# Altium schematic sheet vehicle.SchDoc
size A
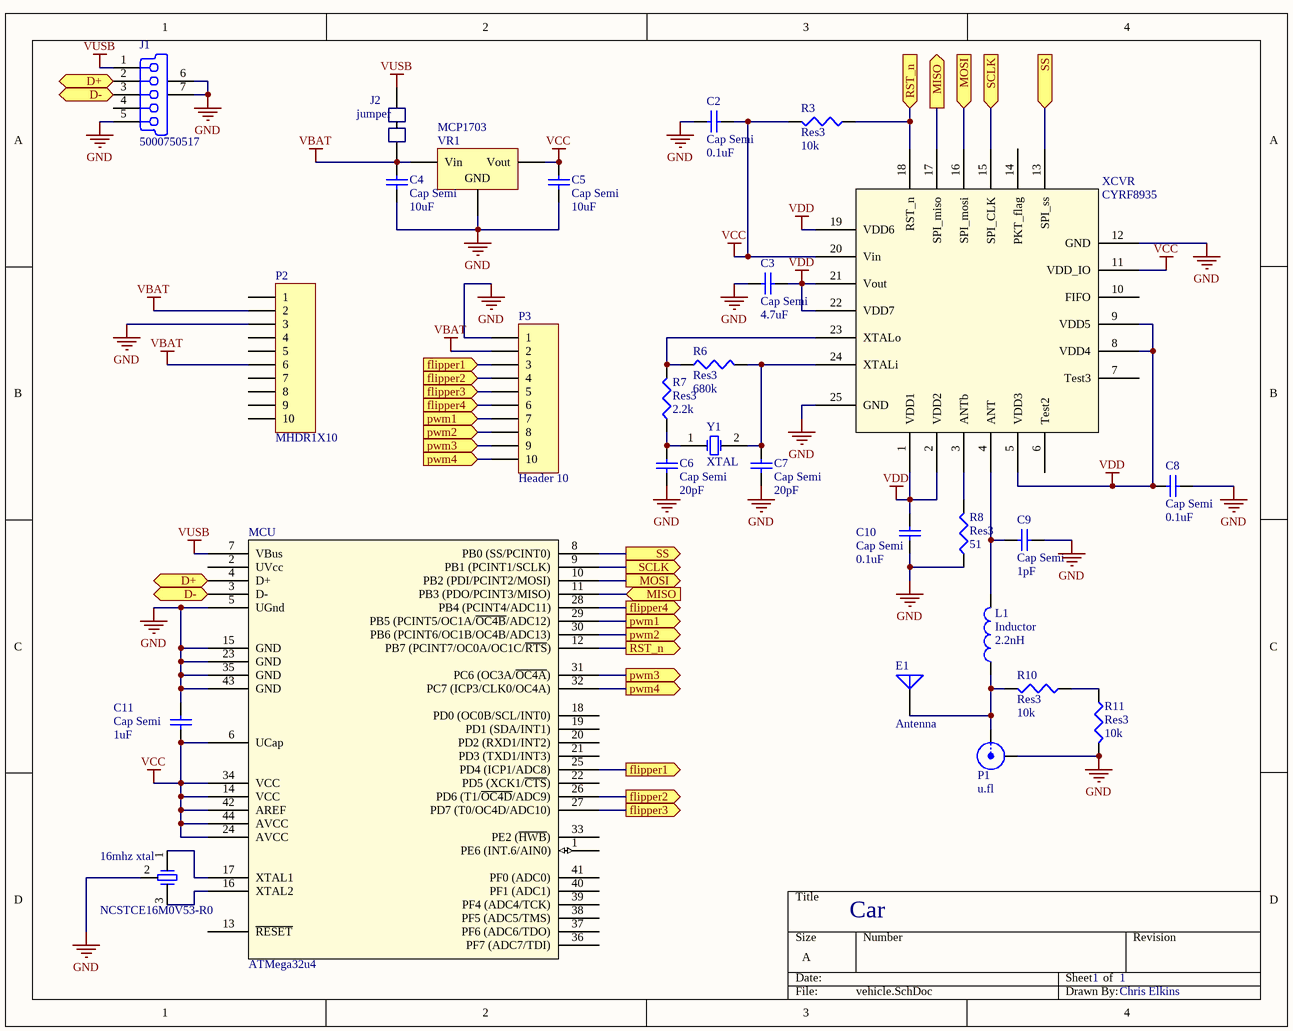
[diagram p0: vehicle.SchDoc]

## Parts
16mhz_xtal  NCSTCE16M0V53-R0  [OSC]
C2  Cap Semi  value 0.1uF  [CAPC1608L]
C3  Cap Semi  value 4.7uF  [CAPC1608L]
C4  Cap Semi  value 10uF  [CAPC1608L]
C5  Cap Semi  value 10uF  [CAPC1608L]
C6  Cap Semi  value 20pF  [CAPC1608L]
C7  Cap Semi  value 20pF  [CAPC1608L]
C8  Cap Semi  value 0.1uF  [CAPC1608L]
C9  Cap Semi  value 1pF  [CAPC1608L]
C10  Cap Semi  value 0.1uF  [CAPC1608L]
C11  Cap Semi  value 1uF  [CAPC1608L]
E1  Antenna  [PIN1]
J1  5000750517  [HDR1X4]
J2  jumper  [jumper pad]
L1  Inductor  value 2.2nH  [INDC1608L]
MCU  ATMega32u4  [TQFP44_M]
P1  u.fl  [U.FL connector]
P2  MHDR1X10  [MHDR1X10]
P3  Header 10  [HDR1X10]
R3  Res3  value 10k  [RESC1608L]
R6  Res3  value 680k  [RESC1608L]
R7  Res3  value 2.2k  [RESC1608L]
R8  Res3  value 51  [RESC1608L]
R10  Res3  value 10k  [RESC1608L]
R11  Res3  value 10k  [RESC1608L]
VR1  MCP1703  [SOT223-4N]
XCVR  CYRF8935  [QFN50P400X400-24VAL]
Y1  XTAL  [PCBComponent_1]

## Ports
D+ (bidir), D- (bidir), flipper1 (in), flipper1 (out), flipper2 (in), flipper2 (out), flipper3 (in), flipper3 (out), flipper4 (in), flipper4 (out), MISO (in), MISO (out), MOSI (in), MOSI (out), pwm1 (in), pwm1 (out), pwm2 (in), pwm2 (out), pwm3 (in), pwm3 (out), pwm4 (in), pwm4 (out), RST_n (in), RST_n (out), SCLK (in), SCLK (out), SS (in), SS (out)

## Nets
GND: 16mhz_xtal.2 C2.1 C3.1 C4.1 C5.1 C6.1 C7.1 C8.1 C9.2 C10.2 C11.2 J1.5(GND) J1.6(MH1) J1.7(MH2) MCU.5(UGnd) MCU.15(GND) MCU.23(GND) MCU.35(GND) MCU.43(GND) P1.2(Y) P2.3 P3.1 R8.1 R11.2 VR1.2(GND) XCVR.12(GND) XCVR.25(GND)
VBAT: C4.2 J2.2 P2.2 P2.6 P3.2 VR1.1(Vin)
VCC: C2.2 C5.2 C11.1 MCU.6(UCap) MCU.14(VCC) MCU.24(AVCC) MCU.34(VCC) MCU.42(AREF) MCU.44(AVCC) R3.2 VR1.3(Vout) XCVR.11(VDD_IO) XCVR.20(Vin)
VDD: C3.2 C8.2 C10.1 XCVR.1(VDD1) XCVR.2(VDD2) XCVR.5(VDD3) XCVR.8(VDD4) XCVR.9(VDD5) XCVR.19(VDD6) XCVR.21(Vout) XCVR.22(VDD7)
VUSB: J1.1(V_BUS) J2.1 MCU.7(VBus)
D+: J1.2(D-) MCU.4(D+) ; port D+
D-: J1.3(D+) MCU.3(D-) ; port D-
flipper1: MCU.25(PD4_(ICP1/ADC8)) P3.3 ; port flipper1
flipper2: MCU.26(PD6_(T1/~{OC4D}/ADC9)) P3.4 ; port flipper2
flipper3: MCU.27(PD7_(T0/OC4D/ADC10)) P3.5 ; port flipper3
flipper4: MCU.28(PB4_(PCINT4/ADC11)) P3.6 ; port flipper4
MISO: MCU.11(PB3_(PDO/PCINT3/MISO)) XCVR.17(SPI_miso) ; port MISO
MOSI: MCU.10(PB2_(PDI/PCINT2/MOSI)) XCVR.16(SPI_mosi) ; port MOSI
pwm1: MCU.29(PB5_(PCINT5/OC1A/~{OC4B}/ADC12)) P3.7 ; port pwm1
pwm2: MCU.30(PB6_(PCINT6/OC1B/OC4B/ADC13)) P3.8 ; port pwm2
pwm3: MCU.31(PC6_(OC3A/~{OC4A})) P3.9 ; port pwm3
pwm4: MCU.32(PC7_(ICP3/CLK0/OC4A)) P3.10 ; port pwm4
RST_n: MCU.12(PB7_(PCINT7/OC0A/OC1C/~{RTS})) R3.1 XCVR.18(RST_n) ; port RST_n
SCLK: MCU.9(PB1_(PCINT1/SCLK)) XCVR.15(SPI_CLK) ; port SCLK
SS: MCU.8(PB0_(SS/PCINT0)) XCVR.13(SPI_ss) ; port SS
Net16mhz_xtal_1: 16mhz_xtal.1 MCU.17(XTAL1)
Net16mhz_xtal_3: 16mhz_xtal.3 MCU.16(XTAL2)
NetC6_2: C6.2 R7.1 Y1.1(OSC1)
NetC7_2: C7.2 R6.2 XCVR.24(XTALi) Y1.2(OSC2)
NetC9_1: C9.1 L1.2 XCVR.4(ANT)
NetE1_1: E1.1(A) L1.1 P1.1(X) R10.2
NetR6_1: R6.1 R7.2 XCVR.23(XTALo)
NetR8_2: R8.2 XCVR.3(ANTb)
NetR10_1: R10.1 R11.1

Not connected (* = marked no-connect by the designer): J1 4(ID); MCU 1(PE6_(INT.6/AIN0)) 2(UVcc) 13(~{RESET}) 18(PD0_(OC0B/SCL/INT0)) 19(PD1_(SDA/INT1)) 20(PD2_(RXD1/INT2)) 21(PD3_(TXD1/INT3)) 22(PD5_(XCK1/~{CTS})) 33(PE2_(~{HWB})) 36(PF7_(ADC7/TDI)) 37(PF6_(ADC6/TDO)) 38(PF5_(ADC5/TMS)) 39(PF4_(ADC4/TCK)) 40(PF1_(ADC1)) 41(PF0_(ADC0)); P2 1 4 5 7 8 9 10; XCVR 6(Test2) 7(Test3) 10(FIFO) 14(PKT_flag)

## Notes on the sheet
- Car
- 1
- Chris Elkins

## Library data of the parts
C2-C11 = Cap Semi: Capacitor (Semiconductor SIM Model); Published: 8-Jun-2000; LatestRevisionDate: 29-May-2009; LatestRevisionNote: IPC-7351 Footprint Added.; PackageReference: C1206; Publisher: Altium Limited; PackageDescription: Chip Capacitor
E1 = Antenna: Generic Antenna; Published: 24-Mar-1999; LatestRevisionDate: 17-Jul-2002; LatestRevisionNote: Re-released for DXP Platform.; PackageReference: PIN1; Publisher: Altium Limited
J1 = 5000750517: USB On-The-Go (OTG) Mini-B Receptacle, Right Angle, Thru-Hole, 0.80mm (.031") Pitch, Solder Tails & Shell Tabs with Dimples; pin to pad: 5>4 6>4 7>4; PCB_Layout: Complies with Manufacturer's Recommendation.; Published: 30-May-2008; DatasheetVersion: rev0, Mar-2004; PackageVersion: rev0, Mar-2004; PackageReference: 5000750517; Publisher: Altium Limited; PackageDescription: USB Mini-B, Type 2, Thru-Hole; 5 Position; Vertical, Body 7.7 x 4.2 x 7.7 mm (LxWxH); ComponentLink1Description: Manufacturer Link; ComponentLink1URL: http://www.molex.com/; ComponentLink2Description: Datasheet; ComponentLink2URL: http://www.molex.com/pdm_docs/sd/5000750517_sd.pdf
J2 = solder jumper
L1 = Inductor: Code_IEC: 1005; Published: 8-Jun-2000; LatestRevisionDate: 29-May-2009; LatestRevisionNote: IPC-7351 Footprint Added.; PackageReference: 0402-A; Publisher: Altium Limited; PackageDescription: Chip Inductor; Code_JEITA: 0402
MCU = ATMega32u4: usb enabled avr microcontroller
P1 = BNC: BNC Elbow Connector; LatestRevisionDate: 17-Jul-2002; LatestRevisionNote: Re-released for DXP Platform.; Publisher: Altium Limited
P2 = MHDR1X10: Header, 10-Pin; LatestRevisionDate: 17-Jul-2002; LatestRevisionNote: Re-released for DXP Platform.; Publisher: Altium Limited
P3 = Header 10: Header, 10-Pin; LatestRevisionDate: 17-Jul-2002; LatestRevisionNote: Re-released for DXP Platform.; Publisher: Altium Limited
R3 R6-R8 R10 R11 = Res3: Resistor; Published: 8-Jun-2000; LatestRevisionDate: 29-May-2009; LatestRevisionNote: IPC-7351 Footprint Added.; PackageReference: J1-0603; Publisher: Altium Limited; PackageDescription: Chip Resistor
VR1 = Volt Reg: Voltage Regulator; Published: 24-Mar-1999; LatestRevisionDate: 29-May-2009; LatestRevisionNote: IPC-7351 Footprint Added.; PackageReference: D2PAK; Publisher: Altium Limited; PackageDescription: 3-Pin Transistor Outline Package 2.54 mm Pitch, 15.1 mm Lead Span
Y1 = XTAL: Crystal Oscillator; Published: 8-Jun-2000; LatestRevisionDate: 17-Jul-2002; LatestRevisionNote: Re-released for DXP Platform.; PackageReference: R38; Publisher: Altium Limited